# Altium schematic sheet 主控.SchDoc
size A3
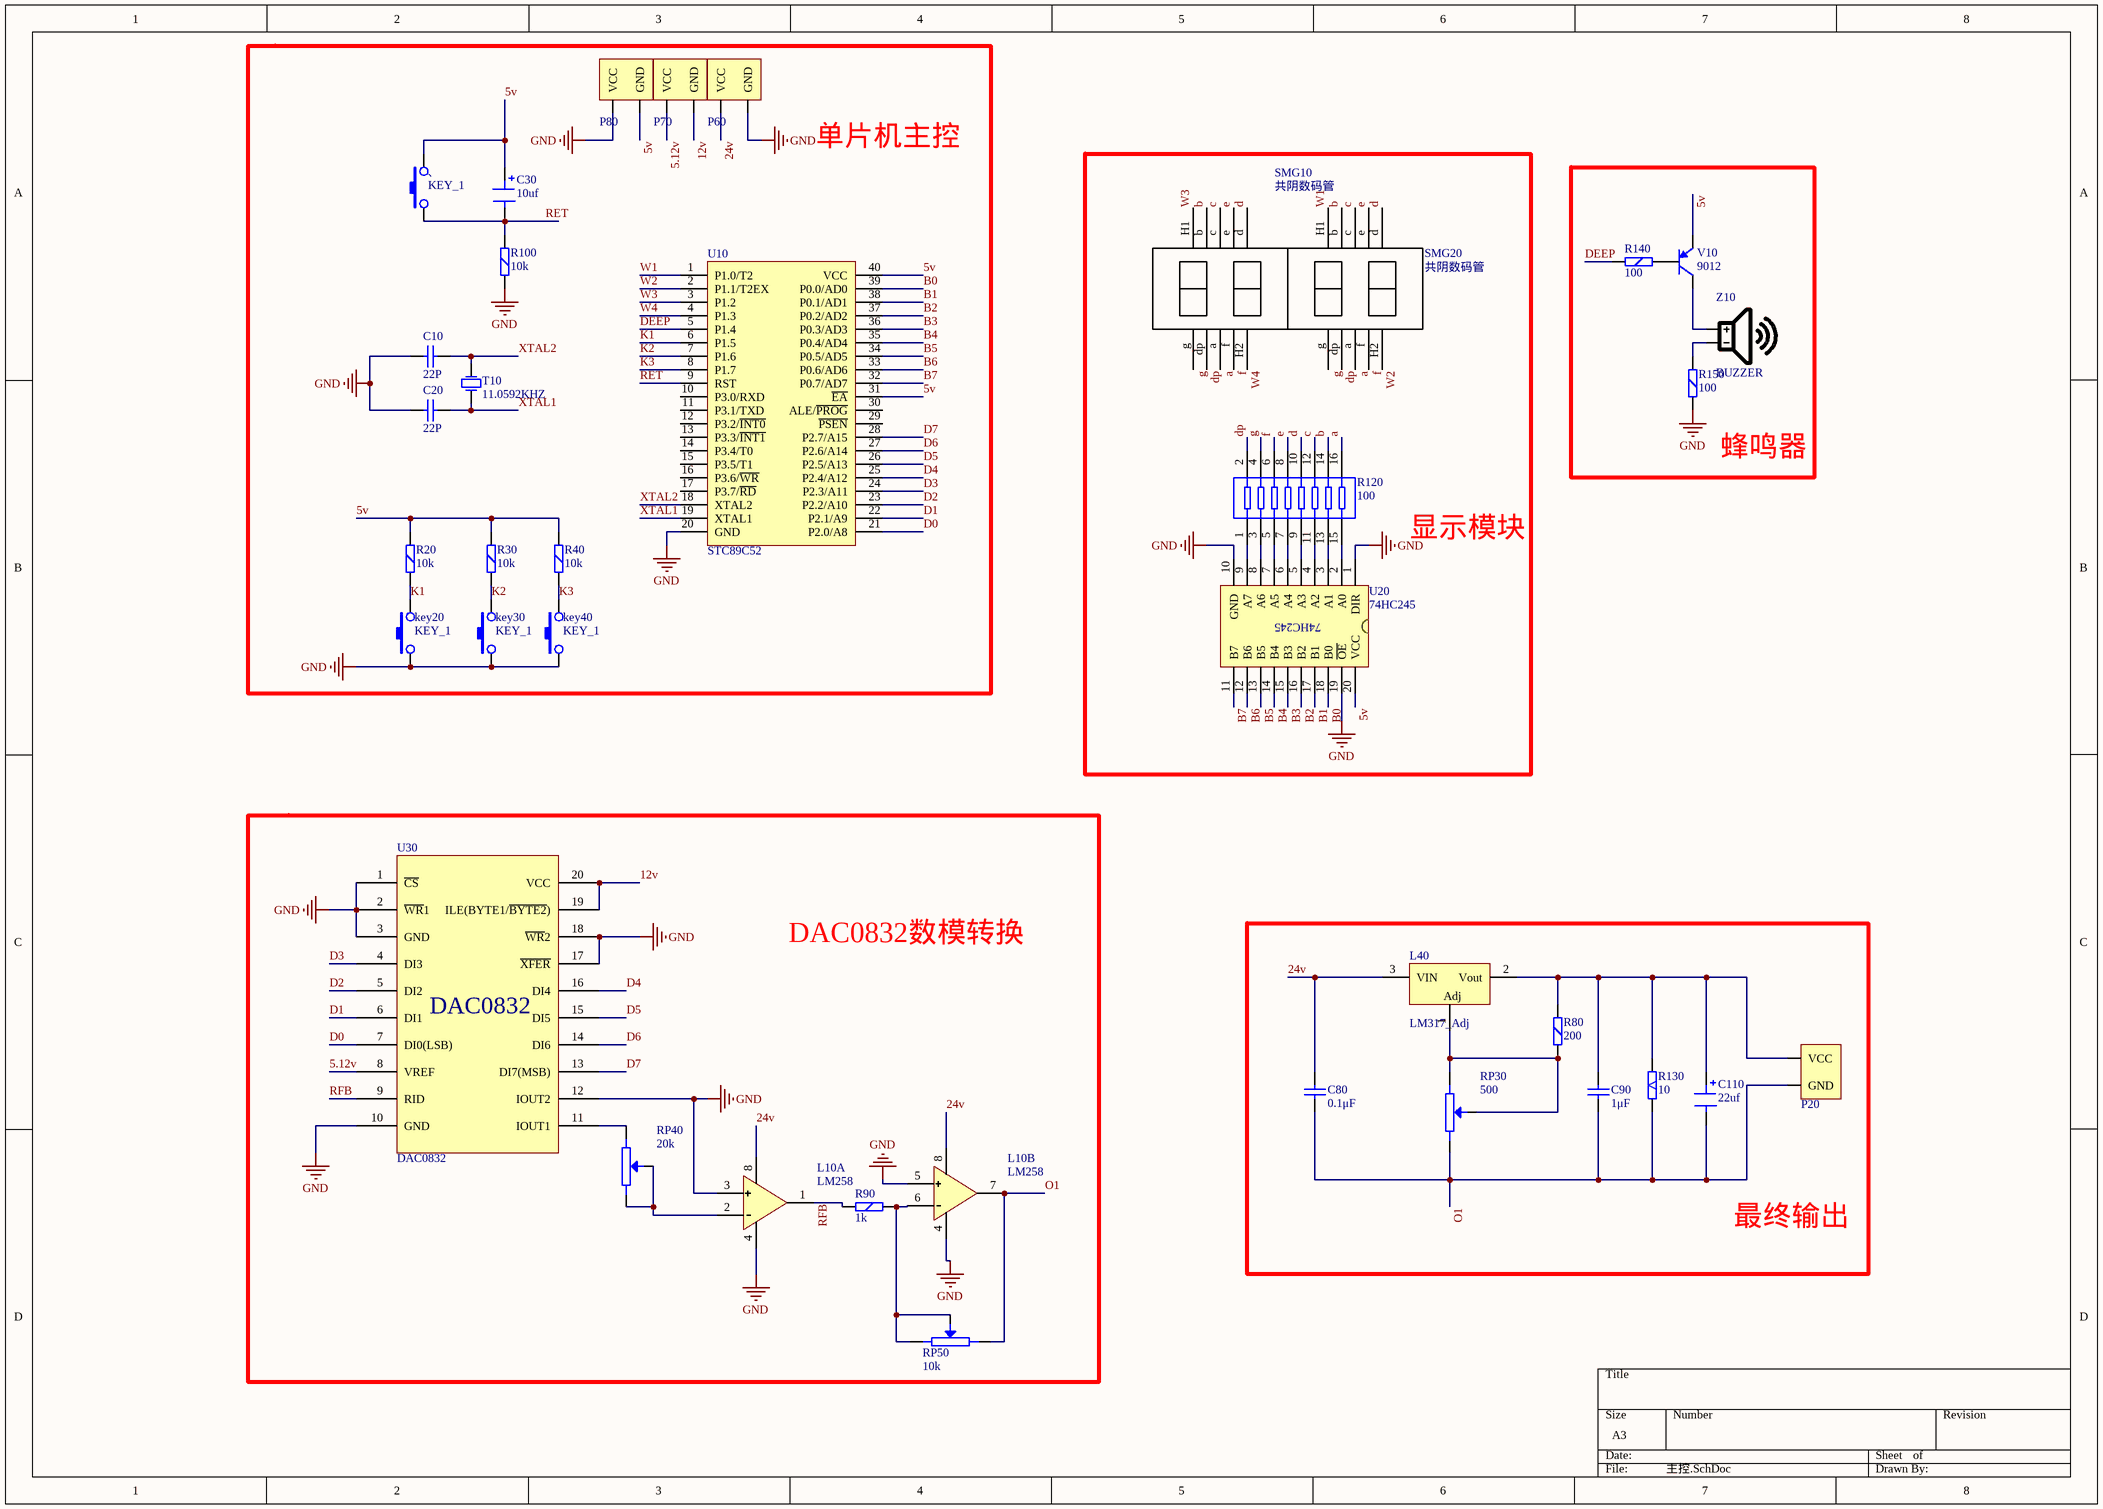
[diagram p0: 主控.SchDoc]

## Parts
C10  22P  [电容_瓷片]
C20  22P  [电容_瓷片]
C30  10uf  [电解电容_小]
C80  0.1μF  [电容_瓷片]
C90  1μF  [电容_瓷片]
C110  22uf  [电解电容_小]
key20  KEY_1  [AN66]
key30  KEY_1  [AN66]
key40  KEY_1  [AN66]
L10  LM258  [DIP8]  (parts A,B of 2)
L40  LM317_Adj  [7805散热器]
P20  电源端子2P  [电源端子2P]  (value not drawn)
P60  电源端子2P  [电源端子2P]  (value not drawn)
P70  电源端子2P  [电源端子2P]  (value not drawn)
P80  电源端子2P  [电源端子2P]  (value not drawn)
R20  10k  [1/4WA1]
R30  10k  [1/4WA1]
R40  10k  [1/4WA1]
R80  200  [1/4WA1]
R90  1k  [1/4WA1]
R100  10k  [1/4WA1]
R120  100  [RES_PACK - 2]
R130  10  [AXIAL-20*5MM-W]
R140  100  [1/4WA1]
R150  100  [1/4WA1]
RP30  500  [3296-103]
RP40  20k  [3296-203]
RP50  10k  [3296-100]
SMG10  共阴数码管  [0.36英寸2位数码管]
SMG20  共阴数码管  [0.36英寸2位数码管]
T10  11.0592KHZ  [晶振_小]
U10  STC89C52  [DIP40]
U20  74HC245  [DIP20]
U30  DAC0832  [DIP20]
V10  9012  [三极管PNP]
Z10  BUZZER  [BUZZER]
、  KEY_1  [AN66]

## Blocks framed on the sheet
单片机主控: C10 C20 C30 key20 key30 key40 P60 P70 P80 R20 R30 R40 R100 T10 U10 、
显示模块: R120 SMG10 SMG20 U20
蜂鸣器: R140 R150 V10 Z10
DAC0832数模转换: L10 R90 RP40 RP50 U30
最终输出: C80 C90 C110 L40 P20 R80 R130 RP30

## Nets
GND: C10.1 C20.1 key20.1 key30.1 key40.1 L10.3 L10.4 L10.5 P60.2(GND) P80.1(VCC) R100.2 R150.1 U10.20(GND) U20.1(DIR) U20.10(GND) U20.19(~{OE}) U30.1(~{CS}) U30.2(~{WR}1) U30.3(GND) U30.10(GND) U30.12(IOUT2) U30.17(~{XFER}) U30.18(~{WR}2)
5.12v: P70.1(VCC) U30.8(VREF)
5v: C30.1 P80.2(GND) R20.1 R30.1 R40.1 U10.31(~{EA}) U10.40(VCC) U20.20(VCC) V10.E 、.2
12v: P70.2(GND) U30.19(ILE(BYTE1/~{BYTE2})) U30.20(VCC)
24v: C80.2 L10.8 L40.3(VIN) P60.1(VCC)
a: R120.16 SMG10.a SMG20.a
b: R120.14 SMG10.b SMG20.b
B0: U10.39(P0.0/AD0) U20.18(B0)
B1: U10.38(P0.1/AD1) U20.17(B1)
B2: U10.37(P0.2/AD2) U20.16(B2)
B3: U10.36(P0.3/AD3) U20.15(B3)
B4: U10.35(P0.4/AD4) U20.14(B4)
B5: U10.34(P0.5/AD5) U20.13(B5)
B6: U10.33(P0.6/AD6) U20.12(B6)
B7: U10.32(P0.7/AD7) U20.11(B7)
c: R120.12 SMG10.c SMG20.c
d: R120.10 SMG10.d SMG20.d
D0: U10.21(P2.0/A8) U30.7(DI0(LSB))
D1: U10.22(P2.1/A9) U30.6(DI1)
D2: U10.23(P2.2/A10) U30.5(DI2)
D3: U10.24(P2.3/A11) U30.4(DI3)
D4: U10.25(P2.4/A12) U30.16(DI4)
D5: U10.26(P2.5/A13) U30.15(DI5)
D6: U10.27(P2.6/A14) U30.14(DI6)
D7: U10.28(P2.7/A15) U30.13(DI7(MSB))
DEEP: R140.1 U10.5(P1.4)
dp: R120.2 SMG10.dp SMG20.dp
e: R120.8 SMG10.e SMG20.e
f: R120.6 SMG10.f SMG20.f
g: R120.4 SMG10.g SMG20.g
K1: key20.2 R20.2 U10.6(P1.5)
K2: key30.2 R30.2 U10.7(P1.6)
K3: key40.2 R40.2 U10.8(P1.7)
O1: C80.1 C90.1 C110.2 L10.7 P20.2(GND) R130.2 RP30.2 RP50.2
RET: C30.2 R100.1 U10.9(RST) 、.1
RFB: L10.1 R90.1 U30.9(RID)
W1: SMG20.H1 U10.1(P1.0/T2)
W2: SMG20.H2 U10.2(P1.1/T2EX)
W3: SMG10.H1 U10.3(P1.2)
W4: SMG10.H2 U10.4(P1.3)
XTAL1: C20.2 T10.2(OSC2) U10.19(XTAL1)
XTAL2: C10.2 T10.1(OSC1) U10.18(XTAL2)
NetC90_2: C90.2 C110.1 L40.2(Vout) P20.1(VCC) R80.1 R130.1
NetL10_2: L10.2 RP40.2 RP40.3
NetL10_6: L10.6 R90.2 RP50.1 RP50.3
NetL40_1: L40.1(Adj) R80.2 RP30.1 RP30.3
NetR120_1: R120.1 U20.9(A7)
NetR120_3: R120.3 U20.8(A6)
NetR120_5: R120.5 U20.7(A5)
NetR120_7: R120.7 U20.6(A4)
NetR120_9: R120.9 U20.5(A3)
NetR120_11: R120.11 U20.4(A2)
NetR120_13: R120.13 U20.3(A1)
NetR120_15: R120.15 U20.2(A0)
NetR140_2: R140.2 V10.B
NetR150_2: R150.2 Z10.2
NetRP40_1: RP40.1 U30.11(IOUT1)
NetV10_C: V10.C Z10.1

Not connected (* = marked no-connect by the designer): U10 10(P3.0/RXD) 11(P3.1/TXD) 12(P3.2/~{INT0}) 13(P3.3/~{INT1}) 14(P3.4/T0) 15(P3.5/T1) 16(P3.6/~{WR}) 17(P3.7/~{RD}) 29(~{PSEN}) 30(ALE/~{PROG})

## Library data of the parts
C10 C20 C80 C90 = 电容_瓷片: 瓷片电容
C30 C110 = 电解电容_小: 电解电容
L40 = LM317: 可调直流稳压芯片
P20 P60 P70 P80 = 电源端子2P: 电源端子
R20 R30 R40 R100 = Res_3: 1/4W电阻器; Object: Resistor; Kind: General; Latest Revision Note: 最近的应用笔记修订本; Component Link1Description: 元件数据连接1，一般是生产厂商的元件描述连接。; ComponentLink2  Description: 元件数据连接2，一般是生产厂商的元件数据库连接。; Component Link 1URL: 元件厂商的网站连接1，通常是主页地址，如http://www.st.com/; Component Link 2URL: 元件厂商的网站连接2，通常是元件数据说明文件地址，如http://www.fairchildsemi.com/ds/2N%2F2N3904.pdf; LatestRevisionDate: 13-Apr-2016; Published: 13-Apr-2016; Publisher: Altium Limited; Created: 制造厂商; Datasheet Version: Apr-2016; Package Reference: AXIAL; Spice Prefix: R; Latest Revision Date: 13-Apr-2016; Package Description: AXIAL0.3-AXIA1.0; PackageVersion: Apr-2016; SubKind: Resistor; Type: Resistor; Value: 10K
R80 R90 R140 R150 = Res_3: 1/4W电阻器; Object: Resistor; Kind: General; Latest Revision Note: 最近的应用笔记修订本; Component Link1Description: 元件数据连接1，一般是生产厂商的元件描述连接。; ComponentLink2  Description: 元件数据连接2，一般是生产厂商的元件数据库连接。; Component Link 1URL: 元件厂商的网站连接1，通常是主页地址，如http://www.st.com/; Component Link 2URL: 元件厂商的网站连接2，通常是元件数据说明文件地址，如http://www.fairchildsemi.com/ds/2N%2F2N3904.pdf; Value: 10K; LatestRevisionDate: 13-Apr-2016; Published: 13-Apr-2016; Publisher: Altium Limited; Created: 制造厂商; Datasheet Version: Apr-2016; Package Reference: AXIAL; Spice Prefix: R; Latest Revision Date: 13-Apr-2016; Package Description: AXIAL0.3-AXIA1.0; PackageVersion: Apr-2016; SubKind: Resistor; Type: Resistor
R120 = Res_Pack8: 排阻; Object: Resistor; Kind: General; Latest Revision Note: 最近的应用笔记修订本; Component Link1Description: 元件数据连接1，一般是生产厂商的元件描述连接。; ComponentLink2  Description: 元件数据连接2，一般是生产厂商的元件数据库连接。; Component Link 1URL: 元件厂商的网站连接1，通常是主页地址，如http://www.st.com/; Component Link 2URL: 元件厂商的网站连接2，通常是元件数据说明文件地址，如http://www.fairchildsemi.com/ds/2N%2F2N3904.pdf; Value: 10K; LatestRevisionDate: 13-Apr-2016; Published: 13-Apr-2016; Publisher: Altium Limited; Created: 制造厂商; Datasheet Version: Apr-2016; Package Reference: AXIAL; Spice Prefix: R; Latest Revision Date: 13-Apr-2016; Package Description: AXIAL0.3-AXIA1.0; PackageVersion: Apr-2016; SubKind: Resistor; Type: Resistor
R130 = Res_7: 5W电阻器; Object: Resistor; Kind: General; Latest Revision Note: 最近的应用笔记修订本; Component Link1Description: 元件数据连接1，一般是生产厂商的元件描述连接。; ComponentLink2  Description: 元件数据连接2，一般是生产厂商的元件数据库连接。; Component Link 1URL: 元件厂商的网站连接1，通常是主页地址，如http://www.st.com/; Component Link 2URL: 元件厂商的网站连接2，通常是元件数据说明文件地址，如http://www.fairchildsemi.com/ds/2N%2F2N3904.pdf; Value: 10K; LatestRevisionDate: 13-Apr-2016; Published: 13-Apr-2016; Publisher: Altium Limited; Created: 制造厂商; Datasheet Version: Apr-2016; Package Reference: AXIAL; Spice Prefix: R; Latest Revision Date: 13-Apr-2016; Package Description: AXIAL0.3-AXIA1.0; PackageVersion: Apr-2016; SubKind: Resistor; Type: Resistor
RP30 RP40 = RESVR: 滑动触点电位器; Object: Resistor; Kind: General; Latest Revision Note: 最近的应用笔记修订本; Component Link1Description: 元件数据连接1，一般是生产厂商的元件描述连接。; ComponentLink2  Description: 元件数据连接2，一般是生产厂商的元件数据库连接。; Component Link 1URL: 元件厂商的网站连接1，通常是主页地址，如http://www.st.com/; Component Link 2URL: 元件厂商的网站连接2，通常是元件数据说明文件地址，如http://www.fairchildsemi.com/ds/2N%2F2N3904.pdf; Value: 10K; LatestRevisionDate: 13-Apr-2016; Published: 13-Apr-2016; Publisher: Altium Limited; Created: 制造厂商; Datasheet Version: Apr-2016; Package Reference: AXIAL; Spice Prefix: R; Latest Revision Date: 13-Apr-2016; Package Description: AXIAL0.3-AXIA1.0; PackageVersion: Apr-2016; SubKind: Resistor; Type: Resistor
RP50 = RESVR: 滑动触点电位器; Object: Resistor; Kind: General; Latest Revision Note: 最近的应用笔记修订本; Component Link1Description: 元件数据连接1，一般是生产厂商的元件描述连接。; ComponentLink2  Description: 元件数据连接2，一般是生产厂商的元件数据库连接。; Component Link 1URL: 元件厂商的网站连接1，通常是主页地址，如http://www.st.com/; Component Link 2URL: 元件厂商的网站连接2，通常是元件数据说明文件地址，如http://www.fairchildsemi.com/ds/2N%2F2N3904.pdf; LatestRevisionDate: 13-Apr-2016; Published: 13-Apr-2016; Publisher: Altium Limited; Created: 制造厂商; Datasheet Version: Apr-2016; Package Reference: AXIAL; Spice Prefix: R; Latest Revision Date: 13-Apr-2016; Package Description: AXIAL0.3-AXIA1.0; PackageVersion: Apr-2016; SubKind: Resistor; Type: Resistor; Value: 10K
SMG10 SMG20 = 二位数码管
T10 = 晶振_小: 晶振
U10 = STC89C52: 51系列单片机; Component Link1Description: 元件数据连接1，一般是生产厂商的元件描述连接。; Component Link 1URL: 元件厂商的网站连接1，通常是主页地址，如http://www.st.com/; ComponentLink2  Description: 元件数据连接2，一般是生产厂商的元件数据库连接。; Component Link 2URL: 元件厂商的网站连接2，通常是元件数据说明文件地址，如http://www.fairchildsemi.com/ds/2N%2F2N3904.pdf; Kind: General; Latest Revision Note: 最近的应用笔记修订本; SubKind: Chip; Created: 制造厂商; Datasheet Version: Jun-2016; Latest Revision Date: 5-Jun-2016; Package Description: DIP-40; Published: 5-Jun-2016; Publisher: Altium Limited; Spice Prefix: U
U20 = 74HC245: 总线驱动器
U30 = DAC0832: 数模转换器件; Component Link1Description: 元件数据连接1，一般是生产厂商的元件描述连接。; Component Link 1URL: 元件厂商的网站连接1，通常是主页地址，如http://www.st.com/; ComponentLink2  Description: 元件数据连接2，一般是生产厂商的元件数据库连接。; Component Link 2URL: 元件厂商的网站连接2，通常是元件数据说明文件地址，如http://www.fairchildsemi.com/ds/2N%2F2N3904.pdf; Kind: General; Latest Revision Note: 最近的应用笔记修订本; SubKind: Chip; 价格: 0.0; Created: 制造厂商; Datasheet Version: Apr-2016; Latest Revision Date: 14-Apr-2016; Package Description: 封装描述; Published: 14-Apr-2016; Publisher: Altium Limited; Spice Prefix: U; LatestRevisionDate: 5-Sep-2016
V10 = 9012三极管: PNP三极管
Z10 = BUZZER: 蜂鸣器